# Altium schematic sheet ADC_MCP3008.SchDoc
size A
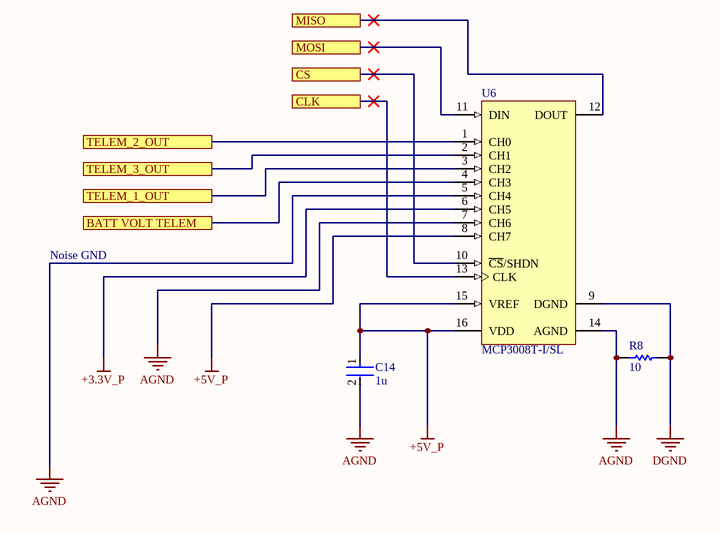
[diagram p0: ADC_MCP3008.SchDoc]

## Parts
C14  1u  [FP-CL31-IPC_B]
R8  10  [RESC3216X60X45ML10T20]
U6  MCP3008T-I/SL  [SOIC-SL16_N]

## Ports
BATT VOLT TELEM, CLK, CS, MISO, MOSI, TELEM_1_OUT, TELEM_2_OUT, TELEM_3_OUT

## Nets
+3.3V_P: U6.6(CH5)
+5V_P: C14.1 U6.8(CH7) U6.15(VREF) U6.16(VDD)
AGND: C14.2 R8.1 U6.5(CH4) U6.7(CH6) U6.14(AGND)
DGND: R8.2 U6.9(DGND)
BATT VOLT TELEM: U6.4(CH3) ; port BATT VOLT TELEM
CLK: U6.13(CLK) ; port CLK
CS: U6.10(~{CS}/SHDN) ; port CS
MISO: U6.12(DOUT) ; port MISO
MOSI: U6.11(DIN) ; port MOSI
TELEM_1_OUT: U6.3(CH2) ; port TELEM_1_OUT
TELEM_2_OUT: U6.1(CH0) ; port TELEM_2_OUT
TELEM_3_OUT: U6.2(CH1) ; port TELEM_3_OUT

## Notes on the sheet
- Noise GND

## Library data of the parts
C14 = CMP-13271-001662-1: Cap Ceramic 1uF 50V X7R ±10% SMD 1206 +125°C Embossed T/R; Case Code (Metric): 3216; Packaging: Tape and Reel; Depth: 1.6mm; Max Operating Temperature: 125°C; Length: 3.2mm; Contact Plating: Tin; Voltage Rating (DC): 50V; Radiation Hardening: No; Min Operating Temperature: -55°C; Dielectric: X7R; Voltage: 50V; Lead Free: Lead Free; Capacitance: 1uF; Package Quantity: 1; Material: Ceramic; Thickness: 0.071inch; Width: 0.063inch; Voltage Rating: 50V; Case Code (Imperial): 1206; Mount: Surface Mount; Case/Package: 1206; Tolerance: 10%; Height: 1.6mm
R8 = CMP-2003-04815-1: Manufacturer: Vishay Dale; Part Number: CRCW120610R0FKEA
U6 = CMP-0188-00351-2: 2.7V 4-Channel/8-Channel 10-Bit A/D Converters with SPI Serial Interface, 16-Pin SOIC 150mil, Industrial Temperature, Tape and Reel; ComponentLink2Description: Datasheet; Code_JEDEC: MS-012-AC; Code_IPC: SOIC127P600-16; ComponentLink1Description: Manufacturer URL; DatasheetVersion: revD, Dec-2008; PackageReference: SOIC-SL16; ComponentLink2URL: http://ww1.microchip.com/downloads/en/DeviceDoc/21295d.pdf; ComponentLink3Description: Package Specification; ComponentLink3URL: http://www.microchip.com/stellent/groups/techpub_sg/documents/packagingspec/en012702.pdf; PackageVersion: revBB, Aug-2009; RevisionNote: URLs added.; PackageDescription: 16-Lead Plastic Small Outline (SL) - Narrow, 3.90mm Body [SOIC]; ComponentLink1URL: http://www.microchip.com/